# Altium schematic sheet MOSFET_killswitch.SchDoc
size A
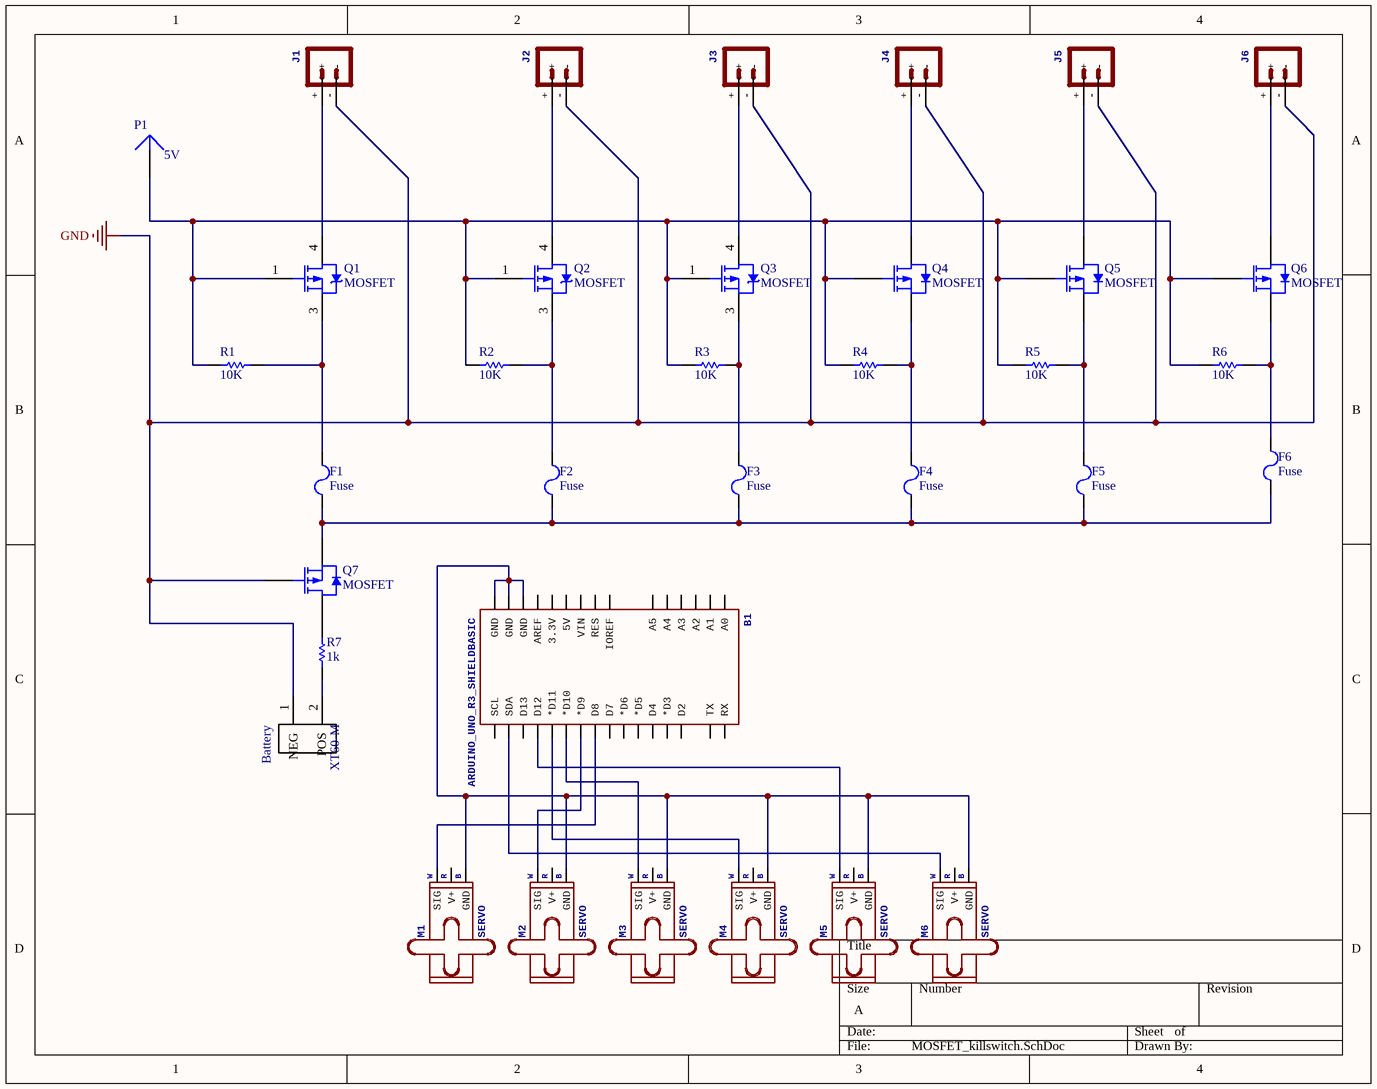
[diagram p0: MOSFET_killswitch.SchDoc]

## Parts
B1  ARDUINO_UNO_R3_SHIELDBASIC  [UNO_R3_SHIELD]
Battery  XT60-M  [*AMASS_XT60-M]
F1  Fuse  [LFUS-45X_V]
F2  Fuse  [LFUS-45X_V]
F3  Fuse  [LFUS-45X_V]
F4  Fuse  [LFUS-45X_V]
F5  Fuse  [LFUS-45X_V]
F6  Fuse  [LFUS-45X_V]
J1  BATTERY_CONN_DEANS1  [DEANS]  (value not drawn)
J2  BATTERY_CONN_DEANS  [DEANS]  (value not drawn)
J3  BATTERY_CONN_DEANS  [DEANS]  (value not drawn)
J4  BATTERY_CONN_DEANS  [DEANS]  (value not drawn)
J5  BATTERY_CONN_DEANS  [DEANS]  (value not drawn)
J6  BATTERY_CONN_DEANS  [DEANS]  (value not drawn)
M1  SERVO  [1X03]
M2  SERVO  [1X03]
M3  SERVO  [1X03]
M4  SERVO  [1X03]
M5  SERVO  [1X03]
M6  SERVO  [1X03]
P1  5V  [PIN1]
Q1  MOSFET  [ONSC-DPAK-3-369C-01_V]
Q2  MOSFET  [ONSC-DPAK-3-369C-01_V]
Q3  MOSFET  [ONSC-DPAK-3-369C-01_V]
Q4  MOSFET  [VISH-SI2323DS-T1-E3-3_V]
Q5  MOSFET  [VISH-SI2323DS-T1-E3-3_V]
Q6  MOSFET  [VISH-SI2323DS-T1-E3-3_V]
Q7  MOSFET  [VISH-SI2323DS-T1-E3-3_V]
R1  10K  [RESC1609X55X30NL10T20]
R2  10K  [RESC1609X55X30NL10T20]
R3  10K  [RESC1609X55X30NL10T20]
R4  10K  [RESC1609X55X30NL10T20]
R5  10K  [RESC1609X55X30NL10T20]
R6  10K  [RESC1609X55X30NL10T20]
R7  1k  [RESC2013X50X30ML20T20]

## Nets
GND: Battery.1(NEG) J1.- J2.- J3.- J4.- J5.- J6.- Q7.1(G)
NetB1_D8: B1.D8 M1.1(SIG)
NetB1_D9: B1.D9(*D9) M2.1(SIG)
NetB1_D10: B1.D10(*D10) M3.1(SIG)
NetB1_D11: B1.D11(*D11) M4.1(SIG)
NetB1_D12: B1.D12 M5.1(SIG)
NetB1_GND@0: B1.GND@0(GND) B1.GND@1(GND) B1.GND@2(GND) M1.3(GND) M2.3(GND) M3.3(GND) M4.3(GND) M5.3(GND) M6.3(GND)
NetB1_SDA: B1.SDA M6.1(SIG)
NetBattery_2: Battery.2(POS) R7.1
NetF1_1: F1.1 F2.1 F3.1 F4.1 F5.1 F6.1 Q7.2(S)
NetF1_2: F1.2 Q1.3(S) R1.2
NetF2_2: F2.2 Q2.3(S) R2.2
NetF3_2: F3.2 Q3.3(S) R3.2
NetF4_2: F4.2 Q4.2(S) R4.2
NetF5_2: F5.2 Q5.2(S) R5.2
NetF6_2: F6.2 Q6.2(S) R6.2
NetJ1_+: J1.+ Q1.4(D)
NetJ2_+: J2.+ Q2.4(D)
NetJ3_+: J3.+ Q3.4(D)
NetJ4_+: J4.+ Q4.3(D)
NetJ5_+: J5.+ Q5.3(D)
NetJ6_+: J6.+ Q6.3(D)
NetP1_1: P1.1 Q1.1(G) Q2.1(G) Q3.1(G) Q4.1(G) Q5.1(G) Q6.1(G) R1.1 R2.1 R3.1 R4.1 R5.1 R6.1
NetQ7_3: Q7.3(D) R7.2

Not connected (* = marked no-connect by the designer): B1 3.3V 5V A0 A1 A2 A3 A4 A5 AREF D2 D3(*D3) D4 D5(*D5) D6(*D6) D7 D13 IOREF RES RX SCL TX VIN; M1 2(V+); M2 2(V+); M3 2(V+); M4 2(V+); M5 2(V+); M6 2(V+)

## Library data of the parts
B1 = ARDUINO_UNO_R3_SHIELDBASIC: Arduino R3 Shield Footprint Shield form compatible with the Arduino Uno R3.    SparkFun Products:  MG2639 Cellular Shield  MIDI Shield R3 Stackable Headers Kit; GateName_1: G$1; SymbolName_1: ARDUINO_R3_SHIELD; DeviceName: BASIC; LibraryName: SparkFun-Boards; DeviceSetName: ARDUINO_UNO_R3_SHIELD
Battery = XT60-M: MF: AMASS; Availability: Unavailable; Price: None; MP: XT60-M; Package: Package Analog Devices; SnapEDA_Link: https://www.snapeda.com/parts/XT60-M/AMASS/view-part/?ref=snap; Value: *
F1-F6 = CMP-2000-05687-1: Fuse, 65 V, 15 A, -55 to 125 degC, 2-Pin SMD, RoHS, Tape and Reel; Manufacturer: Littelfuse; Response Characteristic: VeryFastActing; Current Rating: 15A; Working Voltage-Max: 65V; Package Description: 2-Pin Surface Mount Device, Body 6.1 x 2.69 mm; Manufacturer URL: http://www.littelfuse.com/; Datasheet Version: 02/2016; Datasheet URL: http://www.littelfuse.com/products/fuses/surface-mount-fuses/nano-2-fuses/~/media/electronics/datasheets/fuses/littelfuse_fuse_451_453_datasheet.pdf.pdf; Mounting Technology: SurfaceMount; Package Reference: 45X; Operating Temp Range: -55to+125°C; Size: 6.10x2.69mm
J1-J6 = BATTERY_CONN_DEANS: Battery Connectors    Various footprints for battery connections   SparkFun Products:  Deans Connector -M/F Pair; GateName_1: G$1; DeviceName: _DEANS; SF_ID: PRT-11864; SymbolName_1: BATTERY_CONN; LibraryName: SparkFun-Connectors; DeviceSetName: BATTERY_CONN
M1-M6 = SERVO: Servo Motor    3-pin connector for a standard servo motor (voltage supply, ground, and control signal.) SparkFun Products  Servo - Generic (Sub-Micro Size) (ROB-09065)  Servo - Generic High Torque Continuous Rotation (Standard Size) (ROB-09347)  Servo - Generic High Torque (Standard Size) (ROB-11965); GateName_1: G$1; SymbolName_1: SMALL_SERVO_MOTOR; LibraryName: SparkFun-Electromechanical; DeviceSetName: SERVO; W: W; R: R; B: B
P1 = Plug: LatestRevisionDate: 17-Jul-2002; LatestRevisionNote: Re-released for DXP Platform.; Publisher: Altium Limited
Q1-Q3 = CMP-1058-00407-1: Power MOSFET -60 V, -15.5 A, Single P-Channel, 3-Pin DPAK, Pb-Free, Tape and Reel; PartNumber: NTD20P06LT4G; Manufacturer: On Semiconductor; V(BR)DSS Min (V): 60; Channel Polarity: P Channel; VGS Max (V): 20; Ciss Typ (pF): 740; ID Max (A): 15.5; PD Max (W): 65; Coss Typ (pF): 207; VGS(th) Max (V): 2; Qrr Typ (nC): 0.13; Crss Typ (pF): 66; ComponentLink1URL: http://www.onsemi.com/; ComponentLink1Description: Manufacturer URL; Configuration: Single; ComponentLink2URL: http://www.onsemi.cn/pub_link/Collateral/NTD20P06L-D.PDF; ComponentLink3Description: Package Specification; Mounting Technology: Surface Mount; RoHS: Pb-Free; ComponentLink3URL: http://www.onsemi.cn/pub_link/Collateral/369C.PDF; PackageVersion: Rev. E, 02/2014; Packing: Tape and Reel; DatasheetVersion: Rev. 6; PackageReference: DPAK-3-369C-01; PackageDescription: 3-Pin Flange Mount, Body 6.54 x 6.095 mm, Pitch 2.29 mm; ComponentLink2Description: Datasheet; Package Type: DPAK-3
Q4-Q7 = CMP-2000-07054-1: P-Channel MOSFET, 20 V, -55 to 150 degC, 3-Pin TO-236, RoHS, Tape and Reel; Manufacturer: Vishay; Vgs - Gate-Source Voltage: 8V; Fall Time: 43ns; Brand: VishaySemiconductors; Vds - Drain-Source Breakdown Voltage: -20V; Unit Weight: 0.050717oz; Number of Channels: 1Channel; Pd - Power Dissipation: 750mW; Rds On - Drain-Source Resistance: 39mOhms; Transistor Type: 1P-Channel; Channel Mode: Enhancement; Configuration: Single; Typical Turn-On Delay Time: 25ns; Id - Continuous Drain Current: 3.7A; Typical Turn-Off Delay Time: 71ns; Mounting Technology: SurfaceMount; Package / Case: SOT-23-3; Minimum Operating Temperature: -55C; RoHS: True; Package Reference: TO-236-3; Datasheet Version: Rev. D, 02/2009; Maximum Operating Temperature: +150C; Height: 1.02mm; Product: MOSFETSmallSignal; Manufacturer URL: http://www.vishay.com/; Technology: Si; Mounting Style: SMD/SMT; Package Description: 3-Pin Plastic Small Outline, Body 2.92 x1.3 mm, Pitch 0.95 mm; Tradename: TrenchFET; Length: 3.04mm; Width: 1.4mm; Series: SI2; Package URL: https://www.vishay.com/docs/71196/71196.pdf; Transistor Polarity: P-Channel; Packaging: Reel; Product Category: MOSFET; Factory Pack Quantity: 3000; Datasheet URL: https://datasheet.ciiva.com/15137/getdatasheetpartid-75162-15137380.pdf; Rise Time: 43ns
R1-R6 = CMP-2000-03691-1: Manufacturer: Vishay Dale; Part Number: TNPW060310K0BEEA
R7 = CMP-2001-03598-1: Part Number: CRCW08051K00JNTA; Manufacturer: Vishay Dale